# EAGLE schematic riffle-proto-grove-1.2 (EAGLE 7.5.0)
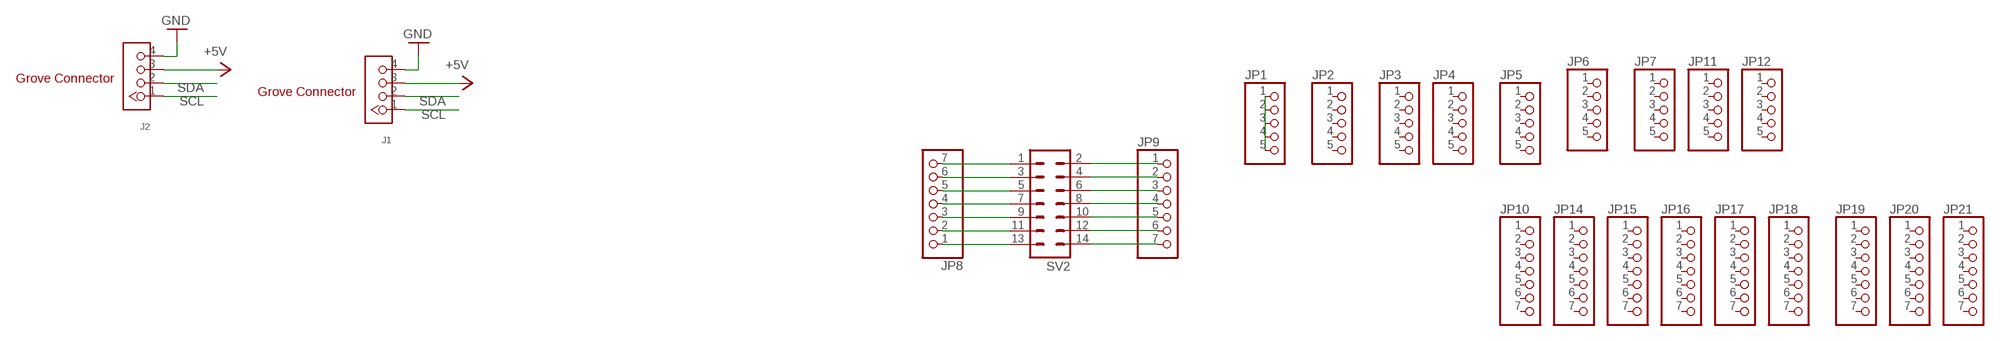
[diagram p0: schematic, sheet 1]

## Parts
J1  TWIG-4P-2.0-2.0  [4P-2.0]
J2  TWIG-4P-2.0-2.0  [4P-2.0]
JP1  HEADER-1X570MIL  [1X05_ROUND_70]
JP2  HEADER-1X570MIL  [1X05_ROUND_70]
JP3  HEADER-1X570MIL  [1X05_ROUND_70]
JP4  HEADER-1X570MIL  [1X05_ROUND_70]
JP5  HEADER-1X570MIL  [1X05_ROUND_70]
JP6  HEADER-1X570MIL  [1X05_ROUND_70]
JP7  HEADER-1X570MIL  [1X05_ROUND_70]
JP8  HEADER-1X770MIL  [1X07_ROUND_70]
JP9  HEADER-1X770MIL  [1X07_ROUND_70]
JP10  HEADER-1X770MIL  [1X07_ROUND_70]
JP11  HEADER-1X570MIL  [1X05_ROUND_70]
JP12  HEADER-1X570MIL  [1X05_ROUND_70]
JP14  HEADER-1X770MIL  [1X07_ROUND_70]
JP15  HEADER-1X770MIL  [1X07_ROUND_70]
JP16  HEADER-1X770MIL  [1X07_ROUND_70]
JP17  HEADER-1X770MIL  [1X07_ROUND_70]
JP18  HEADER-1X770MIL  [1X07_ROUND_70]
JP19  HEADER-1X770MIL  [1X07_ROUND_70]
JP20  HEADER-1X770MIL  [1X07_ROUND_70]
JP21  HEADER-1X770MIL  [1X07_ROUND_70]
SV2  MA07-2  [MA07-2]

## Nets
+5V: J1.3 J2.3
GND: J1.4 J2.4
N$1: JP8.1 SV2.13
N$2: JP8.2 SV2.11
N$3: JP8.3 SV2.9
N$4: JP8.4 SV2.7
N$5: JP8.5 SV2.5
N$6: JP8.6 SV2.3
N$7: JP8.7 SV2.1
N$8: JP9.1 SV2.2
N$9: JP9.2 SV2.4
N$10: JP9.3 SV2.6
N$11: JP9.4 SV2.8
N$12: JP9.5 SV2.10
N$13: JP9.6 SV2.12
N$14: JP9.7 SV2.14
N$15: JP1.1 JP1.2 JP1.3 JP1.4 JP1.5
SCL: J1.1 J2.1
SDA: J1.2 J2.2
Unconnected: JP2.1 JP2.2 JP2.3 JP2.4 JP2.5 JP3.1 JP3.2 JP3.3 JP3.4 JP3.5 JP4.1 JP4.2 JP4.3 JP4.4 JP4.5 JP5.1 JP5.2 JP5.3 JP5.4 JP5.5 JP6.1 JP6.2 JP6.3 JP6.4 JP6.5 JP7.1 JP7.2 JP7.3 JP7.4 JP7.5 JP10.1 JP10.2 JP10.3 JP10.4 JP10.5 JP10.6 JP10.7 JP11.1 JP11.2 JP11.3 JP11.4 JP11.5 JP12.1 JP12.2 JP12.3 JP12.4 JP12.5 JP14.1 JP14.2 JP14.3 JP14.4 JP14.5 JP14.6 JP14.7 JP15.1 JP15.2 JP15.3 JP15.4 JP15.5 JP15.6 JP15.7 JP16.1 JP16.2 JP16.3 JP16.4 JP16.5 JP16.6 JP16.7 JP17.1 JP17.2 JP17.3 JP17.4 JP17.5 JP17.6 JP17.7 JP18.1 JP18.2 JP18.3 JP18.4 JP18.5 JP18.6 JP18.7 JP19.1 JP19.2 JP19.3 JP19.4 JP19.5 JP19.6 JP19.7 JP20.1 JP20.2 JP20.3 JP20.4 JP20.5 JP20.6 JP20.7 JP21.1 JP21.2 JP21.3 JP21.4 JP21.5 JP21.6 JP21.7

## Notes on the sheet
- Grove Connector
- Grove Connector

## Library data of the parts
J1 J2 = Connector:TWIG-4P-2.0
JP1-JP7 JP11 JP12 = microbuilder:HEADER-1X5: PIN HEADER
JP8-JP10 JP14-JP21 = microbuilder:HEADER-1X7: PIN HEADER
SV2 = con-lstb:MA07-2: PIN HEADER; OC_FARNELL: unknown; OC_NEWARK: unknown